# Altium schematic sheet SENSORS_FMU_REV_1B.SchDoc: The Cube TM
size A3; Date: 18/08/2014 1:53:16 PM; DrawnBy: Philip Rowse; SheetNumber: 4; SheetTotal: 10
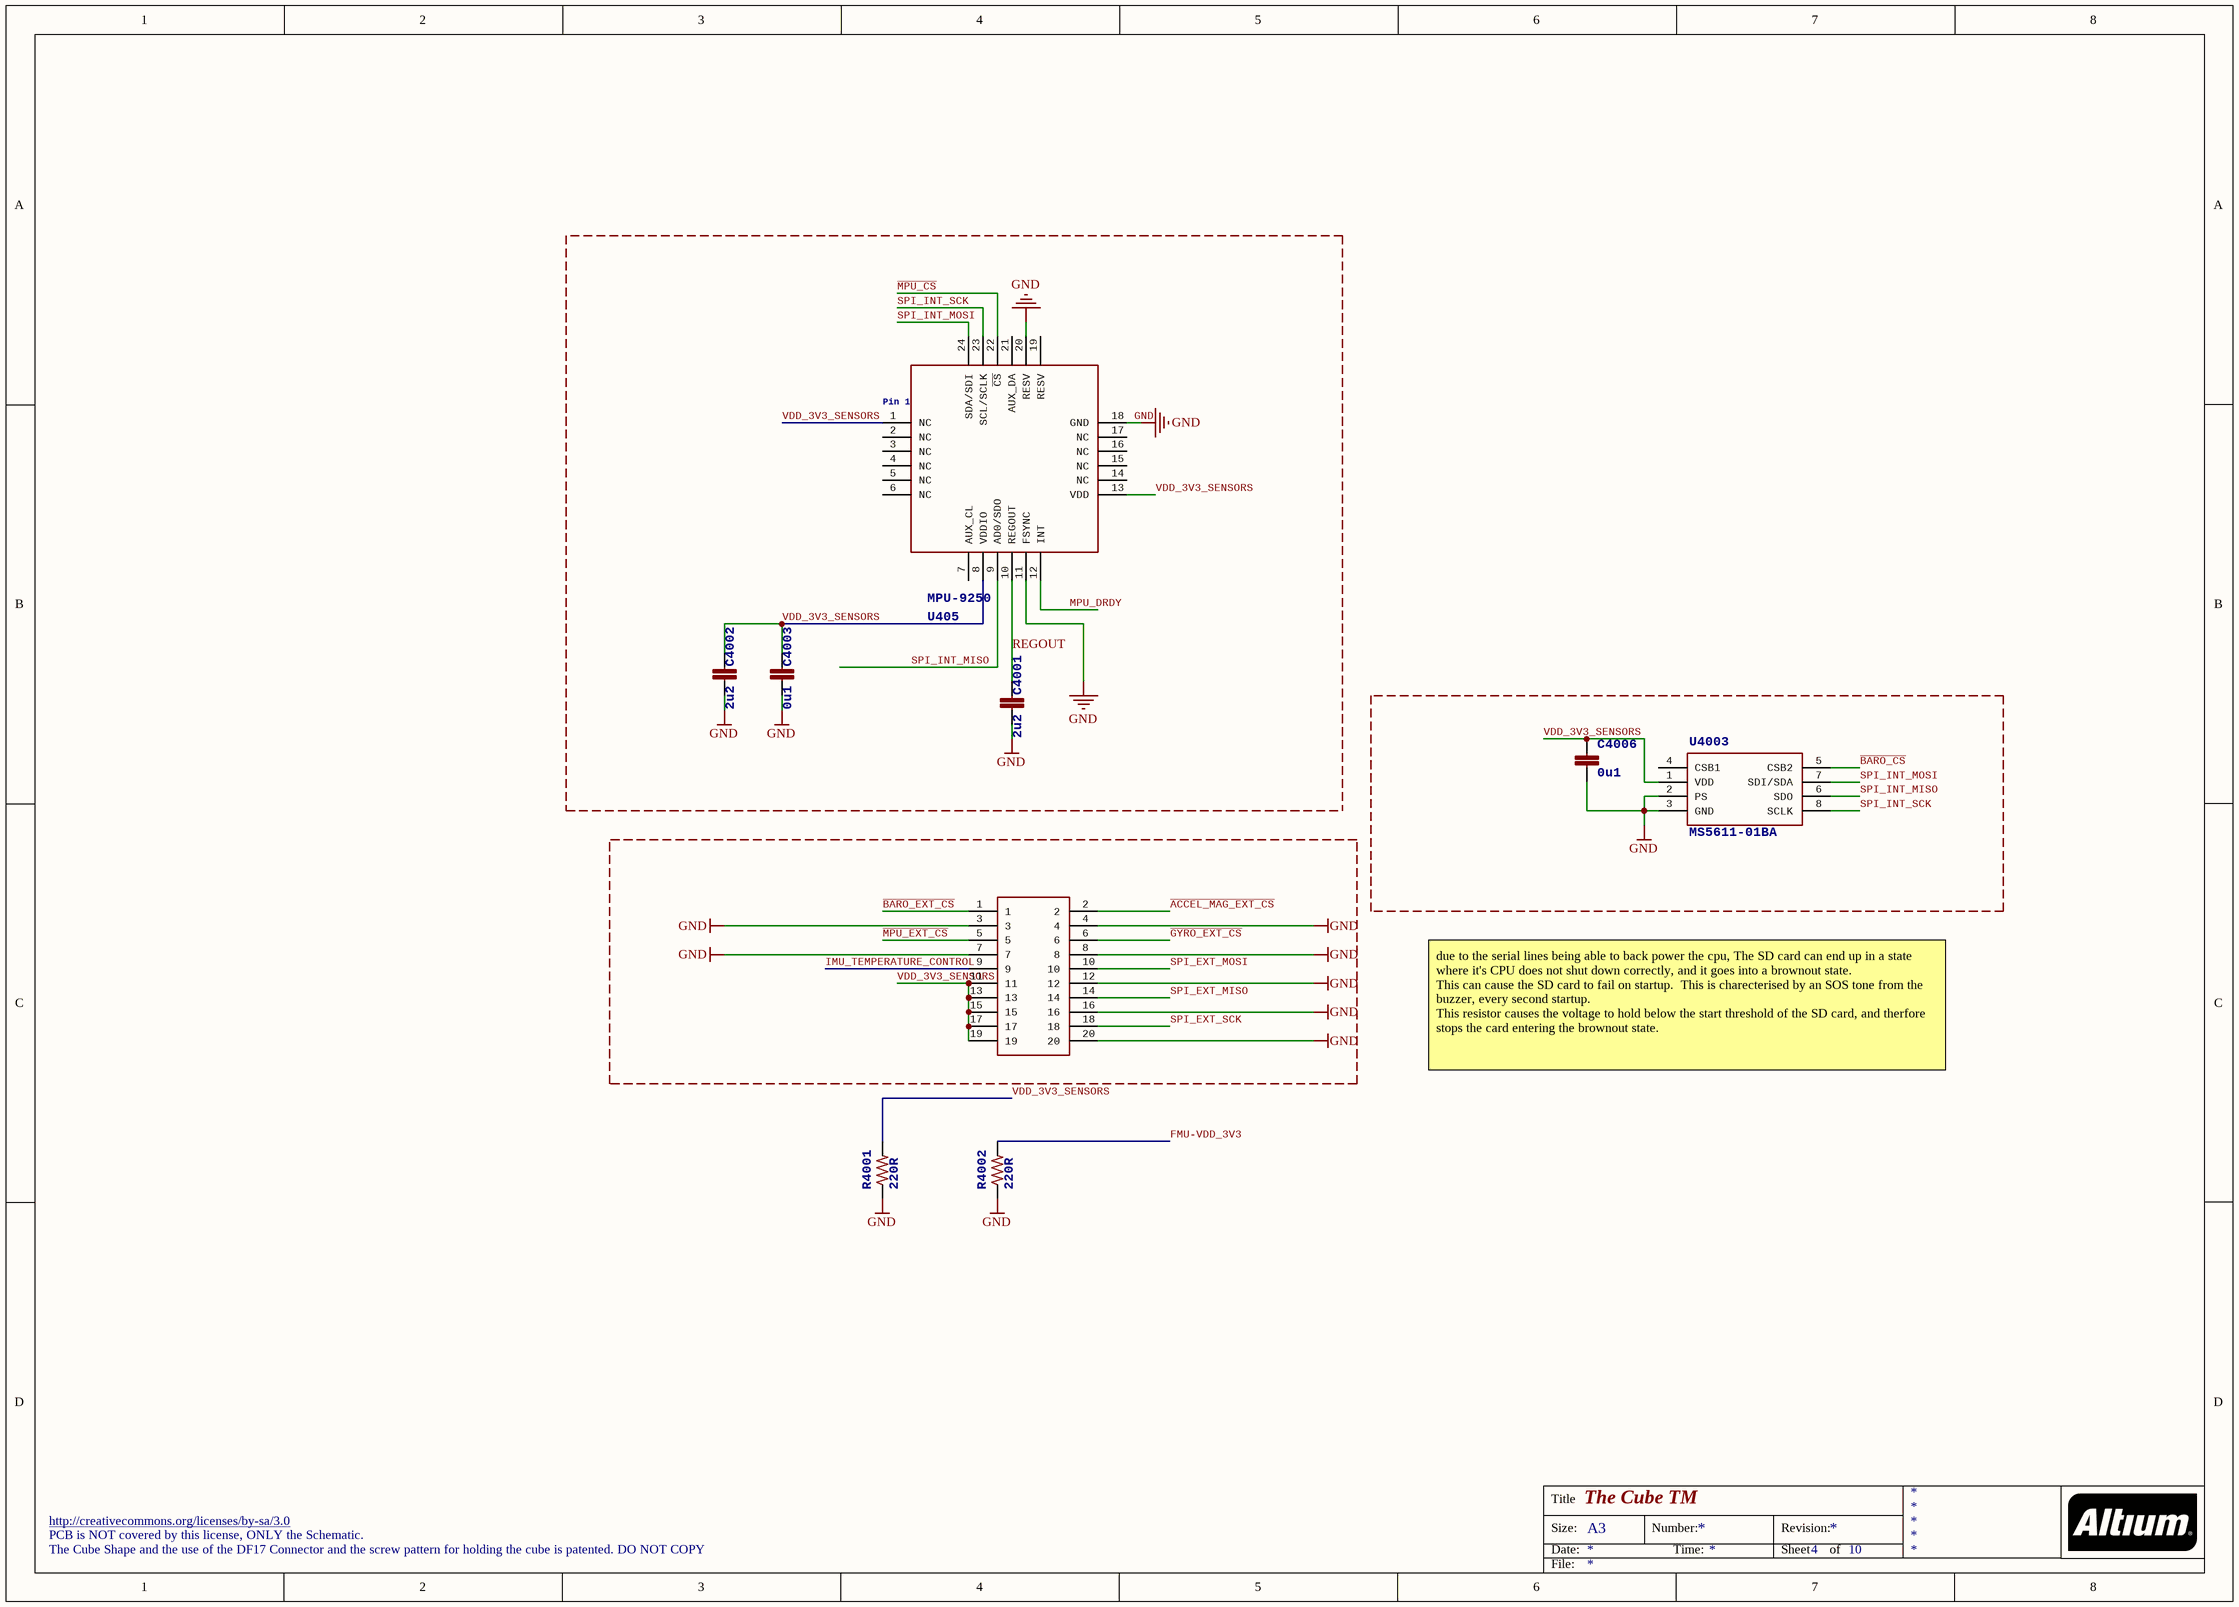
[diagram p0: SENSORS_FMU_REV_1B.SchDoc]

## Parts
C4001  2u2  [0603-CAP]
C4002  2u2  [0603-CAP]
C4003  0u1  [0402-CAP]
C4006  0u1  [0402-CAP]
R4001  220R  [0402-RES]
R4002  220R  [0402-RES]
U405  MPU-9250  [MPU-9250]
U4003  MS5611-01BA  [MS5611-01BA]
U$2  DF40C-20-DS  [DF-40C-20DS]  (value not drawn)

## Nets
GND: C4001.P$2 C4002.P$2 C4003.P$2 C4006.P$2 R4001.P$1 R4002.P$1 U405.11(FSYNC) U405.18(GND) U405.20(RESV) U4003.2(PS) U4003.3(GND) U$2.3 U$2.4 U$2.7 U$2.8 U$2.12 U$2.16 U$2.20
~{ACCEL_MAG_EXT_CS}: U$2.2
~{BARO_CS}: U4003.5(CSB2)
~{BARO_EXT_CS}: U$2.1
FMU-VDD_3V3: R4002.P$2
~{GYRO_EXT_CS}: U$2.6
IMU_TEMPERATURE_CONTROL: U$2.9
~{MPU_CS}: U405.22(~{CS})
~{MPU_EXT_CS}: U$2.5
MPU_DRDY: U405.12(INT)
REGOUT: C4001.P$1 U405.10(REGOUT)
SPI_EXT_MISO: U$2.14
SPI_EXT_MOSI: U$2.10
SPI_EXT_SCK: U$2.18
SPI_INT_MISO: U405.9(AD0/SDO) U4003.6(SDO)
SPI_INT_MOSI: U405.24(SDA/SDI) U4003.7(SDI/SDA)
SPI_INT_SCK: U405.23(SCL/SCLK) U4003.8(SCLK)
VDD_3V3_SENSORS: C4002.P$1 C4003.P$1 C4006.P$1 R4001.P$2 U405.1(NC) U405.8(VDDIO) U405.13(VDD) U4003.1(VDD) U$2.11 U$2.13 U$2.15 U$2.17 U$2.19

Not connected (* = marked no-connect by the designer): U405 2(NC) 3(NC) 4(NC) 5(NC) 6(NC) 7(AUX_CL) 14(NC) 15(NC) 16(NC) 17(NC) 19(RESV) 21(AUX_DA); U4003 4(CSB1)

## Notes on the sheet
- due to the serial lines being able to back power the cpu, The SD card can end up in a state where it's CPU does not shut down correctly, and it goes into a brownout state.
  This can cause the SD card to fail on startup.  This is charecterised by an SOS tone from the buzzer, every second startup.
  This resistor causes the voltage to hold below the start threshold of the SD card, and therfore stops the card entering the brownout state.
- http://creativecommons.org/licenses/by-sa/3.0
- The Cube Shape and the use of the DF17 Connector and the screw pattern for holding the cube is patented. DO NOT COPY
- PCB is NOT covered by this license, ONLY the Schematic.
- Title
- Size:
- Date:
- A3
- Number:
- Time:
- Revision:
- Sheet
- of
- File:

## Library data of the parts
C4001 C4002 = CAP0603: CAP CER 2.2UF 16V 10% X6S 0603; Value: 2u2
C4003 C4006 = CAP0402: CAP CER 0.1UF 16V Y5V 0402; Value: 0u1
R4001 R4002 = RESISTOR0402-RES: RES 220 OHM 1/16W 1% 0402 SMD; Value: 220R
U405 = MPU-6500: Pin 1: Pin 1
U4003 = MS5611-01BA: Board Mount Pressure Sensors; Value: 10-1200mbar
U$2 = DF40C-20-DS: CONN RCPT 20POS 0.4MM SMD GOLD